# Altium schematic sheet PERIPHERAL_PORT_IO.SchDoc: Peripheral Port IO
size B; Engineer: M. Jones; Organization: Michael Jones; DocumentNumber: 5; Revision: RA.1; SheetNumber: 5; SheetTotal: 7
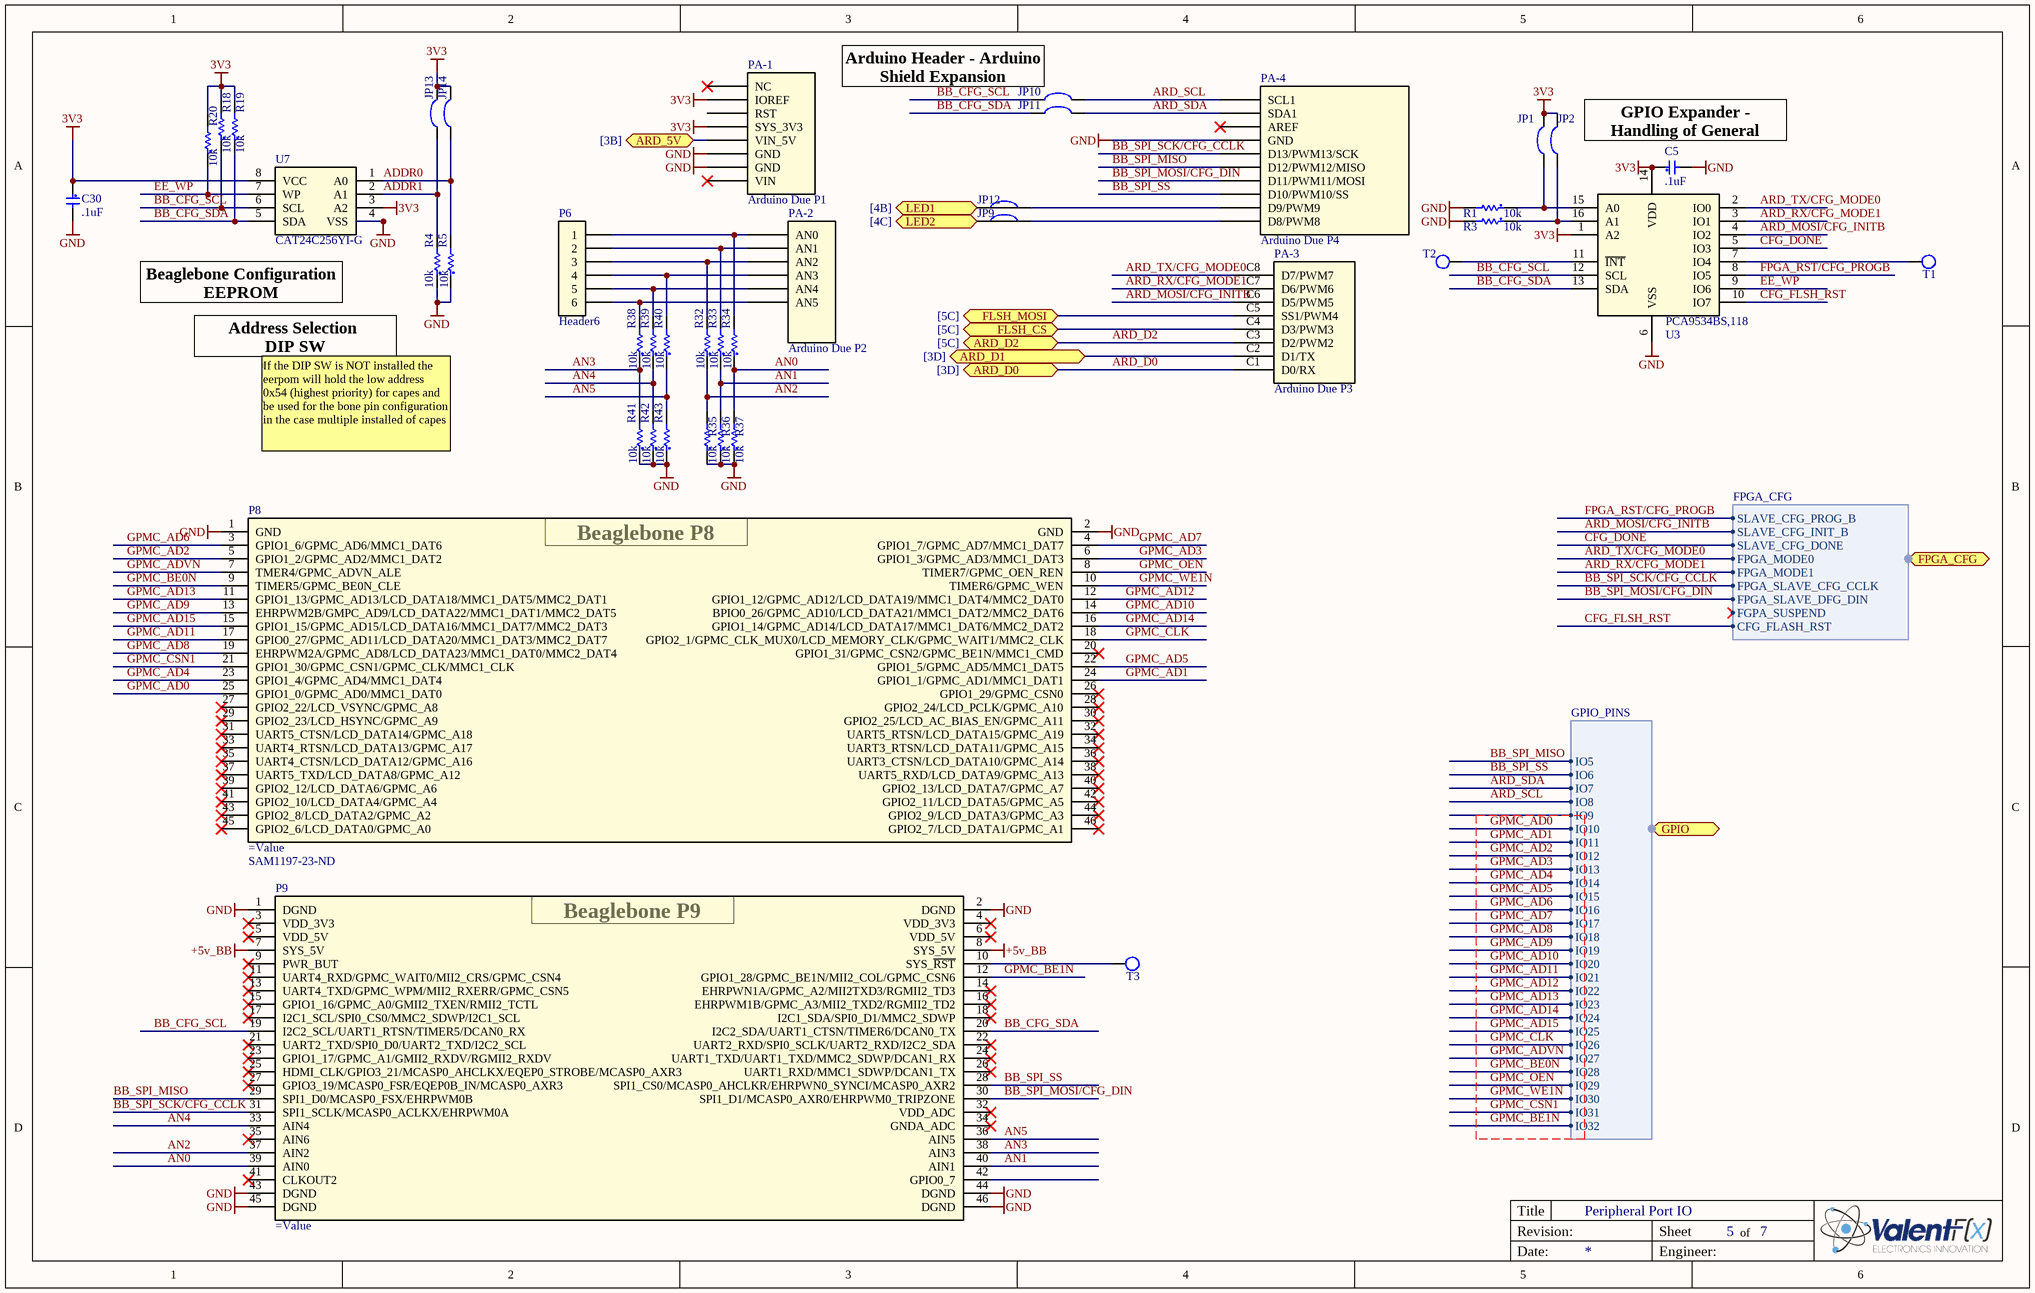
[diagram p0: PERIPHERAL_PORT_IO.SchDoc]

## Parts
C5  .1uF  [c0603]
C30  .1uF  [c0603]
JP1  Solder Jumper  [SOLDER_JUMPER]  (value not drawn)  (net tie, no BOM)
JP2  Solder Jumper  [SOLDER_JUMPER]  (value not drawn)  (net tie, no BOM)
JP9  Solder Jumper-NC  [SOLDER_JUMPER-NC]  (value not drawn)  (net tie, no BOM)
JP10  Solder Jumper  [SOLDER_JUMPER]  (value not drawn)  (net tie, no BOM)
JP11  Solder Jumper  [SOLDER_JUMPER]  (value not drawn)  (net tie, no BOM)
JP12  Solder Jumper-NC  [SOLDER_JUMPER-NC]  (value not drawn)  (net tie, no BOM)
JP13  Solder Jumper  [SOLDER_JUMPER]  (value not drawn)  (net tie, no BOM)
JP14  Solder Jumper  [SOLDER_JUMPER]  (value not drawn)  (net tie, no BOM)
P6  Header6  [HEADER_6_40_100 THRU SIP]  (no BOM)
P8  Supplier Part Number 1: SAM1197-23-ND  [Beaglebone-SSQ]
P9  (no value)  [Beaglebone-SSQ]
PA-1  Arduino Due P1  [Arduino Due P1]
PA-2  Arduino Due P2  [Arduino Due P2]
PA-3  Arduino Due P3  [Arduino Due P3]
PA-4  Arduino Due P4  [Arduino Due P4]
R1  10k  [R0603]
R3  10k  [R0603]
R4  10k  [R0603]
R5  10k  [R0603]
R18  10k  [R0603]
R19  10k  [R0603]
R20  10k  [R0603]
R32  10k  [R0603]
R33  10k  [R0603]
R34  10k  [R0603]
R35  10k  [R0603]
R36  10k  [R0603]
R37  10k  [R0603]
R38  10k  [R0603]
R39  10k  [R0603]
R40  10k  [R0603]
R41  10k  [R0603]
R42  10k  [R0603]
R43  10k  [R0603]
T1  Test Point  [Tp 25-40]  (value not drawn)  (no BOM)
T2  Test Point  [Tp 25-40]  (value not drawn)  (no BOM)
T3  Test Point  [Tp 25-40]  (value not drawn)  (no BOM)
U3  PCA9534BS,118  [EXP - PCA9534BS,118 - QFN65P400X400X100-16M]
U7  CAT24C256YI-G  [TSSOP 8]

## Ports
ARD_5V (see [3B]), ARD_D0 (see [3D]), ARD_D1 (see [3D]), ARD_D2 (see [5C]), FLSH_CS (see [5C]), FLSH_MOSI (see [5C]), FPGA_CFG (harness FPGA_CFG, see [1D]), GPIO (harness GPIO_PINS, see [1A]), LED1 (see [4B]), LED2 (see [4C])

## Harnesses
FPGA_CFG: SLAVE_CFG_PROG_B, SLAVE_CFG_INIT_B, SLAVE_CFG_DONE, FPGA_MODE0, FPGA_MODE1, FPGA_SLAVE_CFG_CCLK, FPGA_SLAVE_DFG_DIN, FGPA_SUSPEND, CFG_FLASH_RST
GPIO_PINS: IO5, IO6, IO7, IO8, IO9, IO10, IO11, IO12, IO13, IO14, IO15, IO16, IO17, IO18, IO19, IO20, IO21, IO22, IO23, IO24, IO25, IO26, IO27, IO28, IO29, IO30, IO31, IO32

## Nets
3V3: C5.1 C30.1 JP1.2 JP2.2 JP13.2 JP14.2 PA-1.A2(IOREF) PA-1.A4(SYS_3V3) R18.2 R19.2 R20.2 U3.1(A2) U3.14(VDD) U7.3(A2) U7.8(VCC)
+5v_BB: P9.7(SYS_5V) P9.8(SYS_5V)
GND: C5.2 C30.2 P8.1(GND) P8.2(GND) P9.1(DGND) P9.2(DGND) P9.43(DGND) P9.44(DGND) P9.45(DGND) P9.46(DGND) PA-1.A6(GND) PA-1.A7(GND) PA-4.D7(GND) R1.2 R3.2 R4.1 R5.1 R35.1 R36.1 R37.1 R41.1 R42.1 R43.1 U3.6(VSS) U7.4(VSS)
ADDR0: JP14.1 R5.2 U7.1(A0)
ADDR1: JP13.1 R4.2 U7.2(A1)
AN0: P9.39(AIN0) R34.1 R37.2
AN1: P9.40(AIN1) R33.1 R36.2
AN2: P9.37(AIN2) R32.1 R35.2
AN3: P9.38(AIN3) R38.1 R41.2
AN4: P9.33(AIN4) R39.1 R42.2
AN5: P9.36(AIN5) R40.1 R43.2
ARD_5V: PA-1.A5(VIN_5V) ; port ARD_5V
ARD_D0: PA-3.C1(D0/RX) ; port ARD_D0
ARD_D1: PA-3.C2(D1/TX) ; port ARD_D1
ARD_D2: PA-3.C3(D2/PWM2) ; port ARD_D2
ARD_MOSI/CFG_INITB: PA-3.C6(D5/PWM5) U3.4(IO2) ; port FPGA_CFG.SLAVE_CFG_INIT_B
ARD_RX/CFG_MODE1: PA-3.C7(D6/PWM6) U3.3(IO1) ; port FPGA_CFG.FPGA_MODE1
ARD_SCL: JP10.2 PA-4.D10(SCL1) ; port GPIO.IO8
ARD_SDA: JP11.2 PA-4.D9(SDA1) ; port GPIO.IO7
ARD_TX/CFG_MODE0: PA-3.C8(D7/PWM7) U3.2(IO0) ; port FPGA_CFG.FPGA_MODE0
BB_CFG_SCL: JP10.1 P9.19(I2C2_SCL/UART1_RTSN/TIMER5/DCAN0_RX) R18.1 U3.12(SCL) U7.6(SCL)
BB_CFG_SDA: JP11.1 P9.20(I2C2_SDA/UART1_CTSN/TIMER6/DCAN0_TX) R19.1 U3.13(SDA) U7.5(SDA)
BB_SPI_MISO: P9.29(SPI1_D0/MCASP0_FSX/EHRPWM0B) PA-4.D5(D12/PWM12/MISO) ; port GPIO.IO5
BB_SPI_MOSI/CFG_DIN: P9.30(SPI1_D1/MCASP0_AXR0/EHRPWM0_TRIPZONE) PA-4.D4(D11/PWM11/MOSI) ; port FPGA_CFG.FPGA_SLAVE_DFG_DIN
BB_SPI_SCK/CFG_CCLK: P9.31(SPI1_SCLK/MCASP0_ACLKX/EHRPWM0A) PA-4.D6(D13/PWM13/SCK) ; port FPGA_CFG.FPGA_SLAVE_CFG_CCLK
BB_SPI_SS: P9.28(SPI1_CS0/MCASP0_AHCLKR/EHRPWN0_SYNCI/MCASP0_AXR2) PA-4.D3(D10/PWM10/SS) ; port GPIO.IO6
CFG_DONE: U3.5(IO3) ; port FPGA_CFG.SLAVE_CFG_DONE
CFG_FLSH_RST: U3.10(IO7) ; port FPGA_CFG.CFG_FLASH_RST
EE_WP: R20.1 U3.9(IO6) U7.7(WP)
FLSH_CS: PA-3.C4(D3/PWM3) ; port FLSH_CS
FLSH_MOSI: PA-3.C5(SS1/PWM4) ; port FLSH_MOSI
FPGA_RST/CFG_PROGB: U3.8(IO5) ; port FPGA_CFG.SLAVE_CFG_PROG_B
GPMC_AD0: P8.25(GPIO1_0/GPMC_AD0/MMC1_DAT0) ; port GPIO.IO10
GPMC_AD1: P8.24(GPIO1_1/GPMC_AD1/MMC1_DAT1) ; port GPIO.IO11
GPMC_AD2: P8.5(GPIO1_2/GPMC_AD2/MMC1_DAT2) ; port GPIO.IO12
GPMC_AD3: P8.6(GPIO1_3/GPMC_AD3/MMC1_DAT3) ; port GPIO.IO13
GPMC_AD4: P8.23(GPIO1_4/GPMC_AD4/MMC1_DAT4) ; port GPIO.IO14
GPMC_AD5: P8.22(GPIO1_5/GPMC_AD5/MMC1_DAT5) ; port GPIO.IO15
GPMC_AD6: P8.3(GPIO1_6/GPMC_AD6/MMC1_DAT6) ; port GPIO.IO16
GPMC_AD7: P8.4(GPIO1_7/GPMC_AD7/MMC1_DAT7) ; port GPIO.IO17
GPMC_AD8: P8.19(EHRPWM2A/GPMC_AD8/LCD_DATA23/MMC1_DAT0/MMC2_DAT4) ; port GPIO.IO18
GPMC_AD9: P8.13(EHRPWM2B/GMPC_AD9/LCD_DATA22/MMC1_DAT1/MMC2_DAT5) ; port GPIO.IO19
GPMC_AD10: P8.14(BPIO0_26/GPMC_AD10/LCD_DATA21/MMC1_DAT2/MMC2_DAT6) ; port GPIO.IO20
GPMC_AD11: P8.17(GPIO0_27/GPMC_AD11/LCD_DATA20/MMC1_DAT3/MMC2_DAT7) ; port GPIO.IO21
GPMC_AD12: P8.12(GPIO1_12/GPMC_AD12/LCD_DATA19/MMC1_DAT4/MMC2_DAT0) ; port GPIO.IO22
GPMC_AD13: P8.11(GPIO1_13/GPMC_AD13/LCD_DATA18/MMC1_DAT5/MMC2_DAT1) ; port GPIO.IO23
GPMC_AD14: P8.16(GPIO1_14/GPMC_AD14/LCD_DATA17/MMC1_DAT6/MMC2_DAT2) ; port GPIO.IO24
GPMC_AD15: P8.15(GPIO1_15/GPMC_AD15/LCD_DATA16/MMC1_DAT7/MMC2_DAT3) ; port GPIO.IO25
GPMC_ADVN: P8.7(TMER4/GPMC_ADVN_ALE) ; port GPIO.IO27
GPMC_BE0N: P8.9(TIMER5/GPMC_BE0N_CLE) ; port GPIO.IO28
GPMC_BE1N: P9.12(GPIO1_28/GPMC_BE1N/MII2_COL/GPMC_CSN6) ; port GPIO.IO32
GPMC_CLK: P8.18(GPIO2_1/GPMC_CLK_MUX0/LCD_MEMORY_CLK/GPMC_WAIT1/MMC2_CLK) ; port GPIO.IO26
GPMC_CSN1: P8.21(GPIO1_30/GPMC_CSN1/GPMC_CLK/MMC1_CLK) ; port GPIO.IO31
GPMC_OEN: P8.8(TIMER7/GPMC_OEN_REN) ; port GPIO.IO29
GPMC_WE1N: P8.10(TIMER6/GPMC_WEN) ; port GPIO.IO30
LED1: JP12.1 ; port LED1
LED2: JP9.1 ; port LED2
NetJP1_1: JP1.1 R1.1 U3.15(A0)
NetJP2_1: JP2.1 R3.1 U3.16(A1)
NetJP9_2: JP9.2 PA-4.D1(D8/PWM8)
NetJP12_2: JP12.2 PA-4.D2(D9/PWM9)
NetP6_1: P6.1 PA-2.B1(AN0) R34.2
NetP6_2: P6.2 PA-2.B2(AN1) R33.2
NetP6_3: P6.3 PA-2.B3(AN2) R32.2
NetP6_4: P6.4 PA-2.B4(AN3) R40.2
NetP6_5: P6.5 PA-2.B5(AN4) R39.2
NetP6_6: P6.6 PA-2.B6(AN5) R38.2
NetP9_10: P9.10(SYS_~{RST}) T3.1
NetT1_1: T1.1 U3.7(IO4)
NetT2_1: T2.1 U3.11(~{INT})

Not connected (* = marked no-connect by the designer): P8 20(GPIO1_31/GPMC_CSN2/GPMC_BE1N/MMC1_CMD)* 26(GPIO1_29/GPMC_CSN0)* 27(GPIO2_22/LCD_VSYNC/GPMC_A8)* 28(GPIO2_24/LCD_PCLK/GPMC_A10)* 29(GPIO2_23/LCD_HSYNC/GPMC_A9)* 30(GPIO2_25/LCD_AC_BIAS_EN/GPMC_A11)* 31(UART5_CTSN/LCD_DATA14/GPMC_A18)* 32(UART5_RTSN/LCD_DATA15/GPMC_A19)* 33(UART4_RTSN/LCD_DATA13/GPMC_A17)* 34(UART3_RTSN/LCD_DATA11/GPMC_A15)* 35(UART4_CTSN/LCD_DATA12/GPMC_A16)* 36(UART3_CTSN/LCD_DATA10/GPMC_A14)* 37(UART5_TXD/LCD_DATA8/GPMC_A12)* 38(UART5_RXD/LCD_DATA9/GPMC_A13)* 39(GPIO2_12/LCD_DATA6/GPMC_A6)* 40(GPIO2_13/LCD_DATA7/GPMC_A7)* 41(GPIO2_10/LCD_DATA4/GPMC_A4)* 42(GPIO2_11/LCD_DATA5/GPMC_A5)* 43(GPIO2_8/LCD_DATA2/GPMC_A2)* 44(GPIO2_9/LCD_DATA3/GPMC_A3)* 45(GPIO2_6/LCD_DATA0/GPMC_A0)* 46(GPIO2_7/LCD_DATA1/GPMC_A1)*; P9 3(VDD_3V3)* 4(VDD_3V3)* 5(VDD_5V)* 6(VDD_5V)* 9(PWR_BUT)* 11(UART4_RXD/GPMC_WAIT0/MII2_CRS/GPMC_CSN4)* 13(UART4_TXD/GPMC_WPM/MII2_RXERR/GPMC_CSN5)* 14(EHRPWN1A/GPMC_A2/MII2TXD3/RGMII2_TD3)* 15(GPIO1_16/GPMC_A0/GMII2_TXEN/RMII2_TCTL)* 16(EHRPWM1B/GPMC_A3/MII2_TXD2/RGMII2_TD2)* 17(I2C1_SCL/SPI0_CS0/MMC2_SDWP/I2C1_SCL)* 18(I2C1_SDA/SPI0_D1/MMC2_SDWP)* 21(UART2_TXD/SPI0_D0/UART2_TXD/I2C2_SCL)* 22(UART2_RXD/SPI0_SCLK/UART2_RXD/I2C2_SDA)* 23(GPIO1_17/GPMC_A1/GMII2_RXDV/RGMII2_RXDV)* 24(UART1_TXD/UART1_TXD/MMC2_SDWP/DCAN1_RX)* 25(HDMI_CLK/GPIO3_21/MCASP0_AHCLKX/EQEP0_STROBE/MCASP0_AXR3)* 26(UART1_RXD/MMC1_SDWP/DCAN1_TX)* 27(GPIO3_19/MCASP0_FSR/EQEP0B_IN/MCASP0_AXR3)* 32(VDD_ADC)* 34(GNDA_ADC)* 35(AIN6)* 41(CLKOUT2)* 42(GPIO0_7); PA-1 A1(NC)* A3(RST) A8(VIN)*; PA-4 D8(AREF)*

## Notes on the sheet
- (near JP10) Arduino Header - Arduino Shield Expansion
- GPIO Expander - Handling of General Control Pins
- (near U7) Beaglebone Configuration EEPROM
- Address Selection
  DIP SW
- If the DIP SW is NOT installed the eerpom will hold the low address 0x54 (highest priority) for capes and be used for the bone pin configuration in the case multiple installed of capes
- (near P8) Beaglebone P8
- (near P9) Beaglebone P9
- Title
- Revision:
- Sheet
- of
- Date:
- Engineer:

## Library data of the parts
C5 C30 = C0603 - CL10F104ZA8NNNC: CAP CER 0.1UF 25V Y5V 0603; Manufacturer: Samsung Electro-Mechanics America, Inc; Capacitance: 0.1µF; Tolerance: -20%, +80%; Temperature Coefficient: Y5V (F); Accept Alternative: Yes; Value: .1uF; Supplier 1: Digi-Key; Supplier Part Number 1: 1276-1011-1-ND; Manufacturer Part Number: CL10F104ZA8NNNC; RoHS: RoHS Compliant; Category: Capacitors; Stock 1: 400907; Pricing 1: 1=0.1, 10=0.017, 25=0.012, 50=0.009, 100=0.0076, 250=0.00624, 500=0.00536, 1000=0.00417 (USD); Package / Case: 0603 (1608 Metric); Packaging: Cut Tape (CT); ComponentLink1URL: http://www.samsungsem.com/servlet/FileDownload?type=spec&file=CL10F104ZA8NNNC.pdf; ComponentLink1Description: http://www.samsungsem.com/servlet/FileDownload?type=spec&file=CL10F104ZA8NNNC.pdf; Voltage - Rated: 25V; Mounting Type: Surface Mount, MLCC; Operating Temperature: -30°C ~ 85°C; Applications: General Purpose; Ratings: -; Size / Dimension: 0.063" L x 0.031" W (1.60mm x 0.80mm); Height - Seated (Max): -; Thickness (Max): 0.035" (0.90mm); Lead Spacing: -; Features: -; Lead Style: -; Accept Compatible Replacement Part: Yes
JP1 JP2 JP10 JP11 JP13 JP14 = Solder Jumper: Solder/Configuration Jumper; Manufacturer: n/a; Manufacturer Part Number: n/a; Source: n/a; Source Part Number: n/a; ROHS Certificate: n/a
JP9 JP12 = Solder Jumper-NC: Solder/Configuration Jumper; Manufacturer: n/a; Manufacturer Part Number: n/a; Source: n/a; Source Part Number: n/a; ROHS Certificate: n/a
P6 = Header6: Header 6 pin
P8 = Beagle_Bone_Black_P8-SSQ: Beagle_Bone_Black_P8; Manufacturer: Samtec Inc; Manufacturer Part Number: SSQ-123-03-G-D-RA; Connector Type: Receptacle; Number of Positions: 46; Number of Positions Loaded: All; Pitch: 0.100" (2.54mm); Supplier 1: Digi-Key; RoHS: RoHS Compliant; Category: Connectors, Interconnects; Stock 1: 0; Pricing 1: 1=0 (USD); Packaging: Bulk; Contact Type: Female Socket; Number of Rows: 2; Row Spacing: 0.100" (2.54mm); Mounting Type: Through Hole, Right Angle; Termination: Solder; Fastening Type: -; Features: -; Contact Finish: Gold; Contact Finish Thickness: 20µin (0.51µm); Color: Black; ComponentLink1URL: http://www.samtec.com/documents/webfiles/cpdf/SSQ-1XX-XX-XXX-X-XX-XXX-XX-X-MKT.pdf; ComponentLink1Description: http://www.samtec.com/documents/webfiles/cpdf/SSQ-1XX-XX-XXX-X-XX-XXX-XX-X-MKT.pdf
P9 = Beagle_Bone_Black_P9-SSQ: Beagle_Bone_Black_P9; Manufacturer: Samtec Inc; Manufacturer Part Number: SSQ-123-03-G-D-RA; Connector Type: Receptacle; Number of Positions: 46; Number of Positions Loaded: All; Pitch: 0.100" (2.54mm); Supplier 1: Digi-Key; RoHS: RoHS Compliant; Category: Connectors, Interconnects; Stock 1: 0; Pricing 1: 1=0 (USD); Packaging: Bulk; Contact Type: Female Socket; Number of Rows: 2; Row Spacing: 0.100" (2.54mm); Mounting Type: Through Hole, Right Angle; Termination: Solder; Fastening Type: -; Features: -; Contact Finish: Gold; Contact Finish Thickness: 20µin (0.51µm); Color: Black; ComponentLink1URL: http://www.samtec.com/documents/webfiles/cpdf/SSQ-1XX-XX-XXX-X-XX-XXX-XX-X-MKT.pdf; ComponentLink1Description: http://www.samtec.com/documents/webfiles/cpdf/SSQ-1XX-XX-XXX-X-XX-XXX-XX-X-MKT.pdf; Supplier Part Number 1: SAM1197-23-ND
PA-1 = Arduino Due P1: CONN HEADER FEMALE 8POS .1" GOLD; Manufacturer: Sullins Connector Solutions; Manufacturer Part Number: PPPC081LFBN-RC; Number of Positions: 8; Number of Positions Loaded: All; Pitch: 0.100" (2.54mm); Supplier 1: Digi-Key; RoHS: RoHS Compliant; Category: Connectors, Interconnects; Stock 1: 30245; Pricing 1: 1=0.89, 10=0.69, 25=0.6436, 50=0.585, 100=0.5265, 250=0.4446, 500=0.4212, 1000=0.3744, 2500=0.31122 (USD); Packaging: Bulk; Connector Type: Header; Contact Type: Female Socket; Number of Rows: 1; Row Spacing: -; Mounting Type: Through Hole; Termination: Solder; Fastening Type: -; Features: -; Contact Finish: Gold; Contact Finish Thickness: Flash; Color: Black; ComponentLink1URL: http://www.sullinscorp.com/drawings/78_P(N)PxCxxxLFBN-RC,_10492-G.pdf; ComponentLink1Description: http://www.sullinscorp.com/drawings/78_P(N)PxCxxxLFBN-RC,_10492-G.pdf; Supplier Part Number 1: S7041-ND
PA-2 = Arduino Due P2: CONN HEADER FEMALE 6POS .1" GOLD; Manufacturer: Sullins Connector Solutions; Manufacturer Part Number: PPPC061LFBN-RC; Number of Positions: 6; Number of Positions Loaded: All; Pitch: 0.100" (2.54mm); Supplier 1: Digi-Key; RoHS: RoHS Compliant; Category: Connectors, Interconnects; Stock 1: 9213; Pricing 1: 1=0.7, 10=0.546, 25=0.5088, 50=0.4626, 100=0.4163, 250=0.35152, 500=0.333, 1000=0.296, 2500=0.24605 (USD); Packaging: Bulk; Connector Type: Header; Contact Type: Female Socket; Number of Rows: 1; Row Spacing: -; Mounting Type: Through Hole; Termination: Solder; Fastening Type: -; Features: -; Contact Finish: Gold; Contact Finish Thickness: Flash; Color: Black; ComponentLink1URL: http://www.sullinscorp.com/drawings/78_P(N)PxCxxxLFBN-RC,_10492-G.pdf; ComponentLink1Description: http://www.sullinscorp.com/drawings/78_P(N)PxCxxxLFBN-RC,_10492-G.pdf; Supplier Part Number 1: S7039-ND
PA-3 = Arduino Due P3: CONN HEADER FEMALE 8POS .1" GOLD; Manufacturer: Sullins Connector Solutions; Manufacturer Part Number: PPPC081LFBN-RC; Number of Positions: 8; Number of Positions Loaded: All; Pitch: 0.100" (2.54mm); Supplier 1: Digi-Key; RoHS: RoHS Compliant; Category: Connectors, Interconnects; Stock 1: 30245; Pricing 1: 1=0.89, 10=0.69, 25=0.6436, 50=0.585, 100=0.5265, 250=0.4446, 500=0.4212, 1000=0.3744, 2500=0.31122 (USD); Packaging: Bulk; Connector Type: Header; Contact Type: Female Socket; Number of Rows: 1; Row Spacing: -; Mounting Type: Through Hole; Termination: Solder; Fastening Type: -; Features: -; Contact Finish: Gold; Contact Finish Thickness: Flash; Color: Black; ComponentLink1URL: http://www.sullinscorp.com/drawings/78_P(N)PxCxxxLFBN-RC,_10492-G.pdf; ComponentLink1Description: http://www.sullinscorp.com/drawings/78_P(N)PxCxxxLFBN-RC,_10492-G.pdf; Supplier Part Number 1: S7041-ND
PA-4 = Arduino Due P4: CONN HEADER FMALE 10POS .1" GOLD; Manufacturer: Sullins Connector Solutions; Manufacturer Part Number: PPPC101LFBN-RC; Number of Positions: 10; Number of Positions Loaded: All; Pitch: 0.100" (2.54mm); Supplier 1: Digi-Key; RoHS: RoHS Compliant; Category: Connectors, Interconnects; Stock 1: 5570; Pricing 1: 1=0.84, 10=0.699, 25=0.6476, 50=0.5828, 100=0.518, 250=0.45324, 500=0.4144, 1000=0.37555, 2500=0.3367 (USD); Packaging: Bulk; Connector Type: Header; Contact Type: Female Socket; Number of Rows: 1; Row Spacing: -; Mounting Type: Through Hole; Termination: Solder; Fastening Type: -; Features: -; Contact Finish: Gold; Contact Finish Thickness: Flash; Color: Black; ComponentLink1URL: http://www.sullinscorp.com/drawings/78_P(N)PxCxxxLFBN-RC,_10492-G.pdf; ComponentLink1Description: http://www.sullinscorp.com/drawings/78_P(N)PxCxxxLFBN-RC,_10492-G.pdf; Supplier Part Number 1: S7043-ND
R1 R3-R5 R18-R20 R32-R43 = R0603 - CRCW060310K0FKEA: 10k Thick Film Resistors - SMD 1/10watt 10Kohms 1%; Manufacturer: Vishay Dale; Power (Watts): 0.1W, 1/10W; Temperature Coefficient: ±100ppm/°C; Manufacturer Part Number: CRCW060310K0FKEA; Value: 10k; Supplier 1: Digi-Key; RoHS: RoHS Compliant; Category: Resistors; Stock 1: 997856; Pricing 1: 10=0.081, 50=0.0436, 200=0.0251, 1000=0.01711 (USD); Resistance (Ohms): 10K; Composition: Thick Film; Features: -; Tolerance: ±1%; Size / Dimension: 0.061" L x 0.033" W (1.55mm x 0.85mm); Height: 0.020" (0.50mm); Packaging: Cut Tape (CT); Package / Case: 0603 (1608 Metric); ComponentLink1URL: http://www.vishay.com/doc?20035; ComponentLink1Description: http://www.vishay.com/doc?20035; Supplier Part Number 1: 541-10.0KHCT-ND; Number of Terminations: 2
T1-T3 = Test Point 2: Test Point Smaller Symbol
U3 = EXP - PCA9534BS,118: I/O Expanders, Repeaters & Hubs 8BIT I2C/SMBUS I/O; Manufacturer: NXP Semiconductors; Output Current: 50 mA; Logic Family: PCA; Power Dissipation: 200 mW; Operating Supply Voltage: 2.3 V to 5.5 V; Supplier 1: Mouser; Manufacturer Part Number: PCA9534BS,118; RoHS: RoHS Compliant; Category: I/O Expanders, Repeaters & Hubs; Stock 1: 6089; Pricing 1: 1=1.27, 25=1.16, 100=1.09, 250=1.04, 500=1.00, 1000=0.960, 3000=0.933, 6000=0.899, 12000=0.875 (AUD); Operating Temperature Range: - 40 C to + 85 C; Package / Case: HVQFN-16; Packaging: Reel; Mounting Style: SMD/SMT; Product Category: I/O Expanders; Standard Pack Qty: 6000; RoHS - Mouser: Y; Minimum Order Quantity: 1; Reeling: True; ComponentLink1URL: http://www.nxp.com/documents/data_sheet/PCA9534.pdf; ComponentLink1Description: http://www.nxp.com/documents/data_sheet/PCA9534.pdf; Supplier Part Number 1: 771-PCA9534BS118; Value: PCA9534BS,118
U7 = EEPROM - CAT24C256YI-G: IC EEPROM 256KBIT 400KHZ 8TSSOP; Manufacturer: ON Semiconductor; Format - Memory: EEPROMs - Serial; Memory Size: 256K (32K x 8); Interface: I²C, 2-Wire Serial; Voltage - Supply: 1.8 V ~ 5.5 V; Supplier 1: Digi-Key; Manufacturer Part Number: CAT24C256YI-G; RoHS: RoHS Compliant; Category: Integrated Circuits (ICs); Stock 1: 840; Pricing 1: 1=0.97, 10=0.845, 25=0.7488, 100=0.6521, 250=0.56752, 500=0.483, 1000=0.3864, 2500=0.35018, 5000=0.32603 (USD); Memory Type: EEPROM; Speed: 400kHz; Operating Temperature: -40°C ~ 85°C; Package / Case: 8-TSSOP (0.173", 4.40mm Width); Supplier Device Package: 8-TSSOP; Packaging: Tube; ComponentLink1URL: http://www.onsemi.com/pub_link/Collateral/CAT24C256-D.PDF; ComponentLink1Description: http://www.onsemi.com/pub_link/Collateral/CAT24C256-D.PDF; Supplier Part Number 1: CAT24C256YI-GOS-ND; Value: CAT24C256YI-G